# Altium schematic sheet Reader 103 USB Rev6.schdoc
size 431 x 279 mm; SheetNumber: 0; SheetTotal: 0; PageSetup: Record=PageOptions|CenterHorizontal=True|CenterVertical=True|PrintScale=0.61|XCorrection=1.00|YCorrection=1.00|PrintKind=1|BorderSize=5000000|LeftOffset=0|BottomOffset=0|Orientation=2|PaperLength=1000|PaperWidth=1000|Scale=100|PaperSource=7|PrintQuality=600|MediaType=1|DitherType=10|PaperKind=Letter (8 1/2 x 11 inch)|PrintScaleMode=1
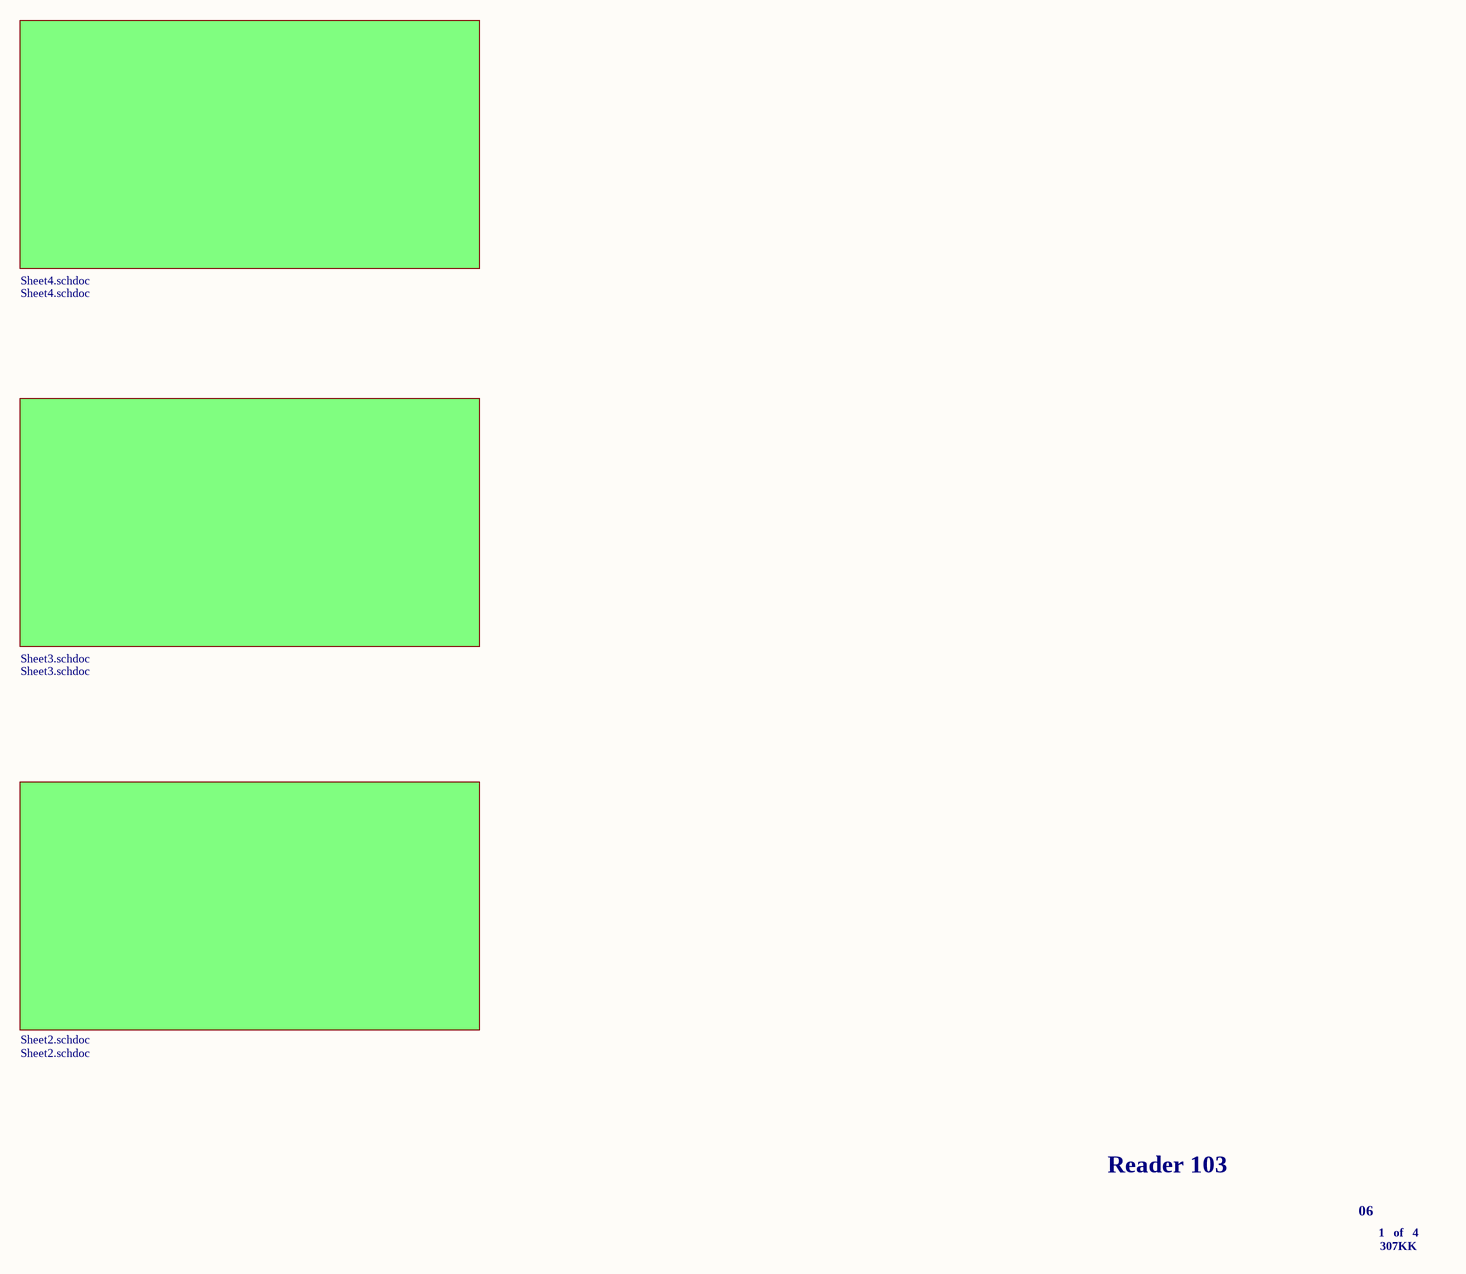
[diagram p0: Reader 103 USB Rev6.schdoc]

## Sub-sheets
Sheet2.schdoc = Sheet2.schdoc: no entries  | Description: Sheet2
Sheet3.schdoc = Sheet3.schdoc: no entries  | Description: Sheet3
Sheet4.schdoc = Sheet4.schdoc: no entries  | Description: Sheet4

## Notes on the sheet
- Reader 103
- 06
- 1   of   4
- 307KK